# Altium schematic sheet UART-LA.SchDoc
size 209 x 297 mm; SheetNumber: 6; SheetTotal: 6
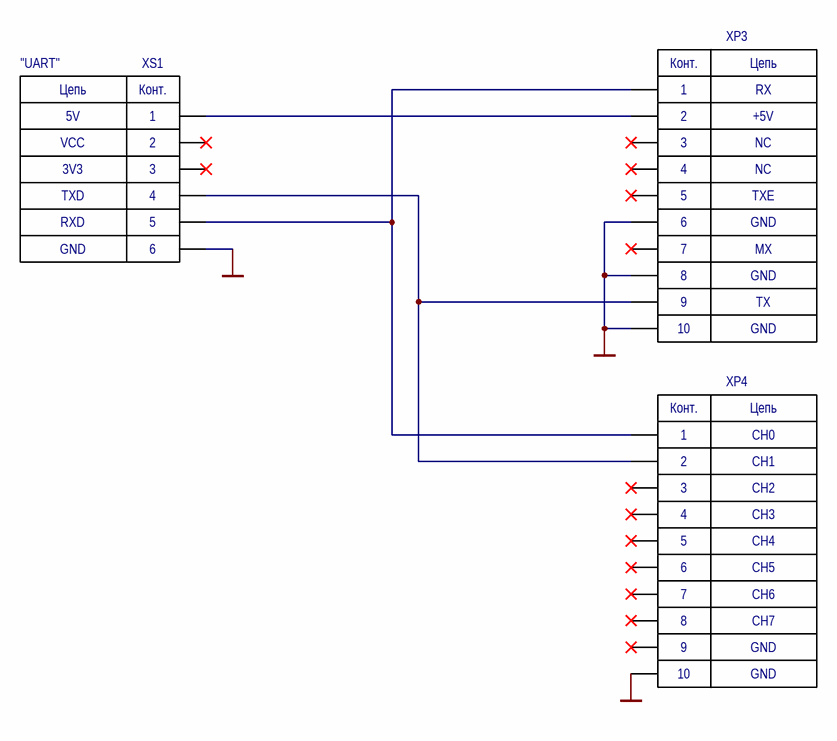
[diagram p0: UART-LA.SchDoc]

## Parts
XP3  Circuit7: MX  Circuit8: GND  Circuit9: TX  Circuit4: NC  Circuit5: TXE  Circuit2: +5V  Circuit1: RX  [IDC-10MS]  (hidden comment: IDC-10MS)
XP4  Circuit7: CH6  Circuit8: CH7  Circuit9: GND  Circuit6: CH5  Circuit4: CH3  Circuit5: CH4  Circuit3: CH2  Circuit2: CH1  Circuit1: CH0  [IDC-10MS]  (hidden comment: IDC-10MS)
XS1  Circuit4: TXD  Circuit5: RXD  Circuit6: GND  Circuit3: 3V3  Circuit1: 5V  Circuit2: VCC  Label: "UART"  [PBS-6R-left]  (hidden comment: PBS-6R)

## Nets
GND: XP3.6 XP3.8 XP3.10 XP4.10 XS1.6
NetXP3_1: XP3.1 XP4.1 XS1.5
NetXP3_2: XP3.2 XS1.1
NetXP3_9: XP3.9 XP4.2 XS1.4

Not connected (* = marked no-connect by the designer): XP3 3* 4* 5* 7*; XP4 3* 4* 5* 6* 7* 8* 9*; XS1 2* 3*

## Notes on the sheet
- (in symbol IDC-10MS) Конт.; Цепь
- (in symbol PBS-6R) Цепь; Конт.

## Library data of the parts
XP3 XP4 = IDC-10MS: Box Header Pitch 2.54mm; Label: "Label"; Circuit10: GND
  XP3: Circuit6: GND; Circuit3: NC
XS1 = PBS-6R: Female Header R/A type Pitch 2.54mm